# Altium schematic sheet Buzzer.SchDoc: Buzzer
size A4; SheetNumber: 9
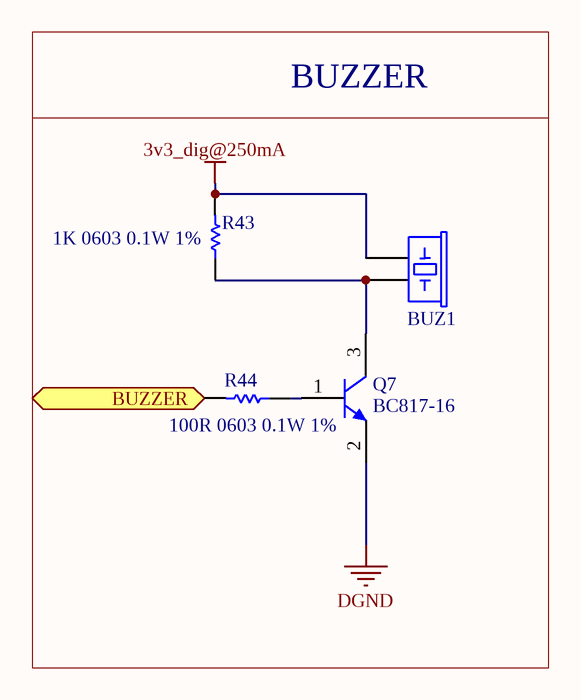
[diagram p0: Buzzer.SchDoc]

## Parts
BUZ1  CUI CMT-1285C-035  [BUZZER-12MM-NS]  (value not drawn)
Q7  BC817-16  [PCB-856332-1]
R43  1K 0603 0.1W 1%  [RESC1609X55X30ML10T20]
R44  100R 0603 0.1W 1%  [RESC1609X55X30ML10T20]

## Blocks framed on the sheet
BUZZER: BUZ1 Q7 R43 R44

## Ports
BUZZER (in)

## Nets
3v3_dig@250mA: BUZ1.1(+) R43.2
DGND: Q7.2(E)
BUZZER: R44.2 ; port BUZZER
NetBUZ1_2: BUZ1.2(-) Q7.3(C) R43.1
NetQ7_1: Q7.1(B) R44.1

## Notes on the sheet
- Title
- Size:
- Date:
- A3
- Author:
- Time:
- Revision:
- Sheet
- of
- File:

## Library data of the parts
BUZ1 = CMP-581a9557be5887dd-1: Audio Buzzer Magnetic 3Vo-p 5Vo-p 70mA 3.5Vo-p 85dB Through Hole Pin Tray; Lead-Free Status: Lead Free; Octopart URL: https://octopart.com/cmt-1285c-035-cui-71811876; Manufacturer Part Number: CMT-1285C-035; Mounting Style: Through Hole; RoHS: Compliant; OctopartID: 581a9557be5887dd; Manufacturer Part Number 2: GMC1205YA-16R2048
Q7 = CMP-856332-3: TRANS NPN 45V 500mA SMD SOT23-3; Current Rating: 0.6 A; Lead-Free Status: Lead Free; Power Dissipation: 0.3 W; Voltage Rating (DC): 40.0 V; Case/Package: SOT-23; Lifecycle Status: Active; Mounting Style: Surface Mount; Number of Pins: 3; Octopart Url: https://octopart.com/mmbt2222a-7-f-diodes+inc.-357838; OctopartID: 53a79aa8030f8c60; Packaging: Cut Tape (CT); Polarity: NPN; REACH SVHC Compliance: No SVHC; RoHS: Compliant
R43 = CMP-a61f6f36030f79d8-4: Manufacturer Part Number: CR0603-FX-1001ELF; Power Rating: 100 mW; Case/Package (SI): 1608; Voltage Rating (DC): 50.0 V; Temperature Coefficient: -100 ppm/°C to 100 ppm/°C; REACH SVHC Compliance: No SVHC; Packaging: Tape & Reel (TR), Cut Tape (CT); Resistance Tolerance: ±1%; Resistance: 1k; RoHS: Compliant; Mounting Style: Surface Mount; Number of Pins: 2; Size-Length: 1.60 mm; Octopart URL: https://octopart.com/cr0603-fx-1001elf-bourns-2326646; Size-Thickness: 457 µm; OctopartID: a61f6f36030f79d8; Size-Width: 787 µm; Case/Package: 0603
R44 = CMP-a61f6f36030f79d8-4: Manufacturer Part Number: ERJ3GEYJ101V; Power Rating: 100 mW; Resistance: 1k; Case/Package (SI): 1608; Voltage Rating (DC): 50.0 V; Temperature Coefficient: -100 ppm/°C to 100 ppm/°C; REACH SVHC Compliance: No SVHC; Packaging: Tape & Reel (TR), Cut Tape (CT); Resistance Tolerance: ±1%; RoHS: Compliant; Mounting Style: Surface Mount; Number of Pins: 2; Size-Length: 1.60 mm; Octopart URL: https://octopart.com/cr0603-fx-1001elf-bourns-2326646; Size-Thickness: 457 µm; OctopartID: a61f6f36030f79d8; Size-Width: 787 µm; Case/Package: 0603